# EAGLE design main_pcb_v2 (EAGLE 9.2.2)
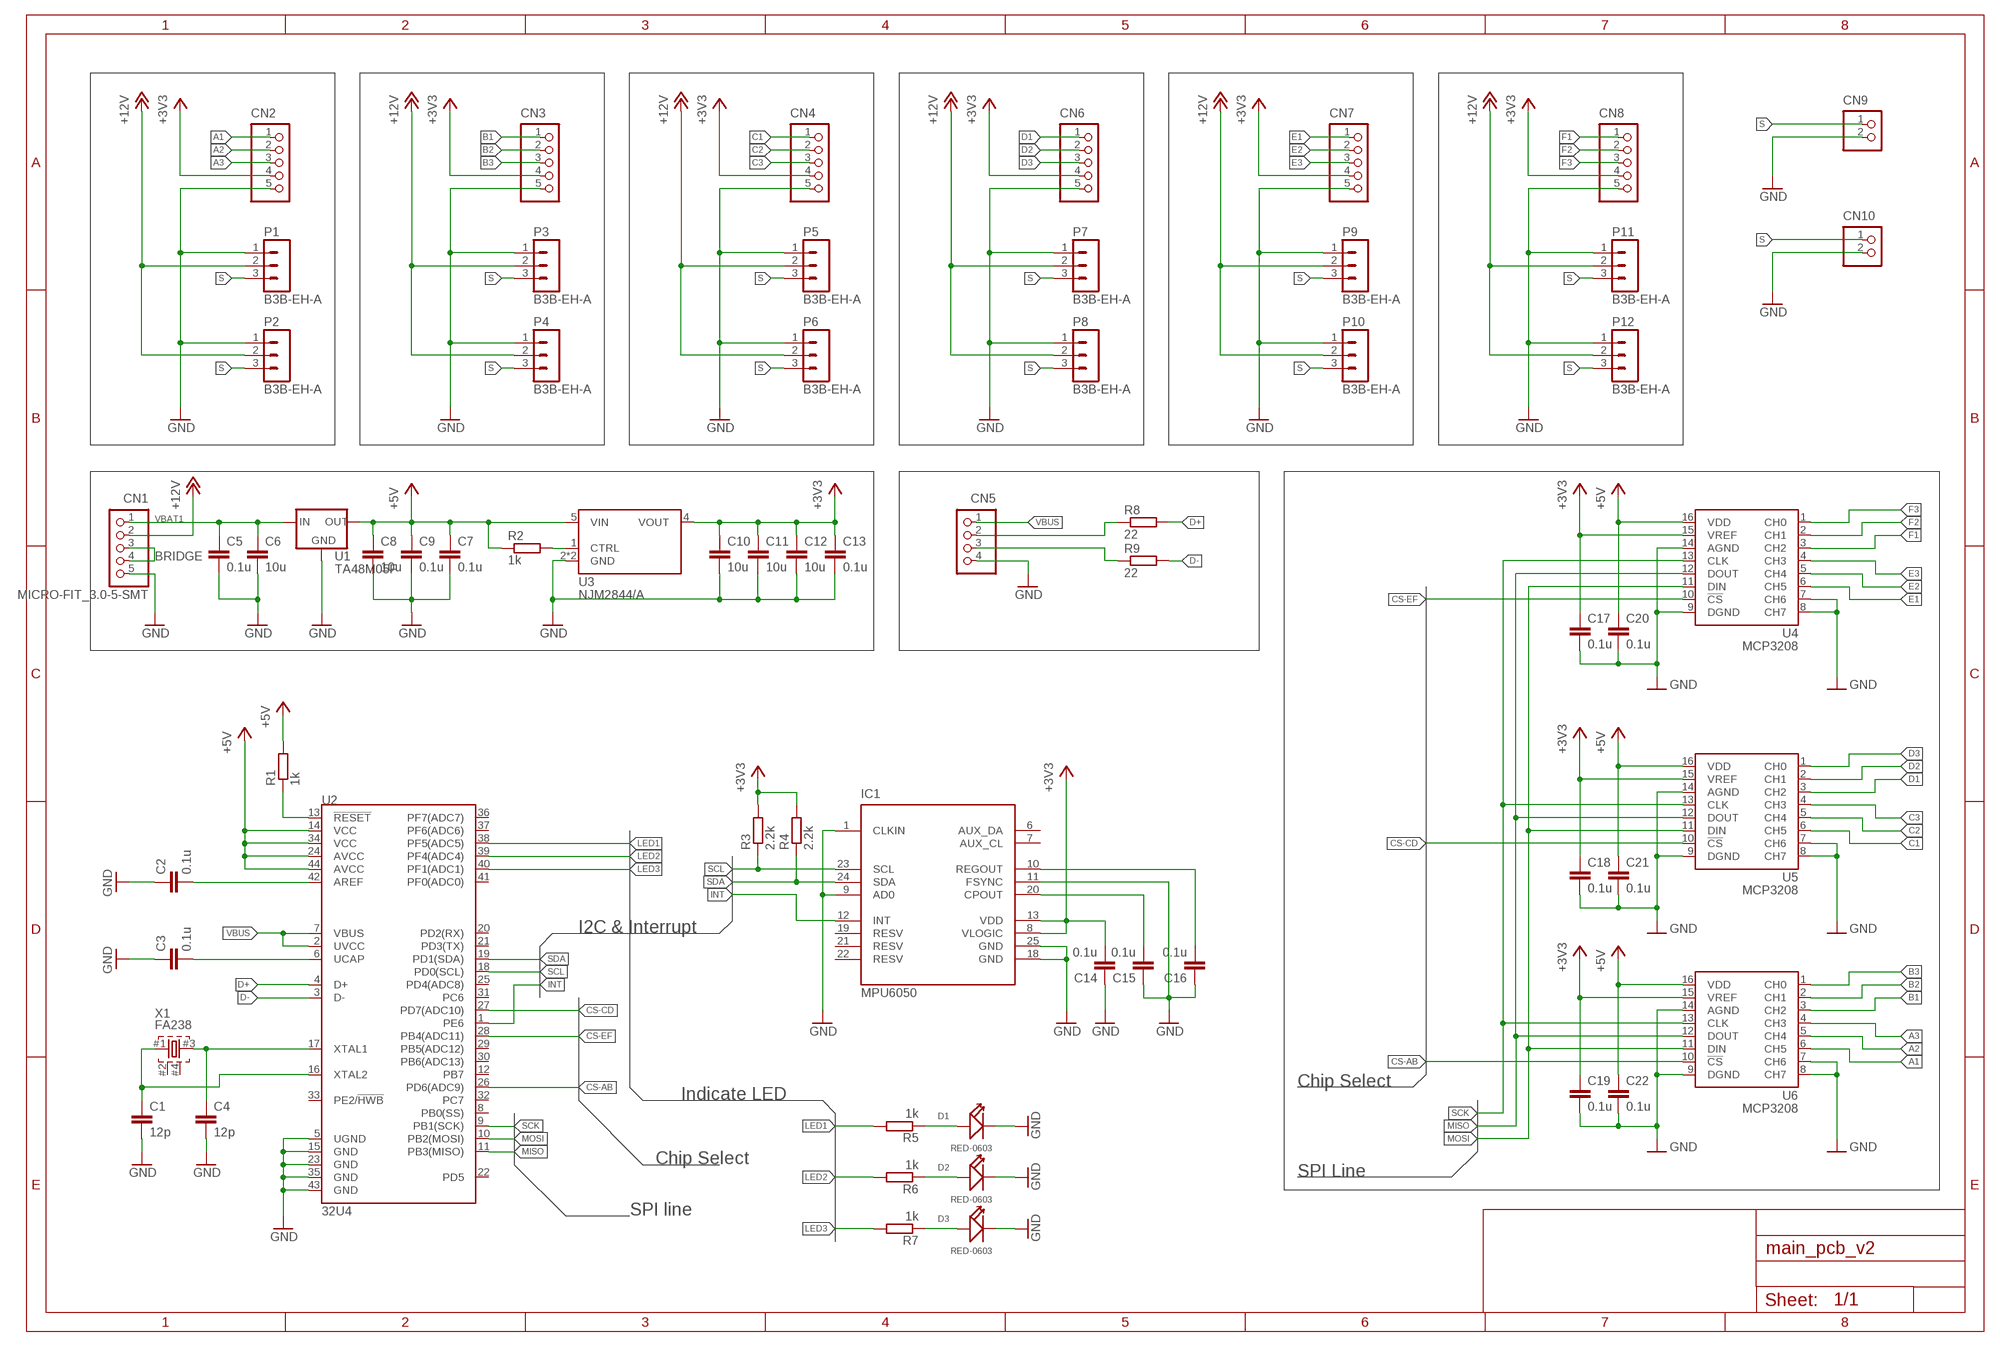
[diagram p0: schematic, sheet 1]

## Parts
C1  12p  C-EUC0603  [C0603]
C2  0.1u  C-EUC0603  [C0603]
C3  0.1u  C-EUC0603  [C0603]
C4  12p  C-EUC0603  [C0603]
C5  0.1u  C-EUC0603  [C0603]
C6  10u  C-EUC0805  [C0805]
C7  0.1u  C-EUC0603  [C0603]
C8  10u  C-EUC0805  [C0805]
C9  0.1u  C-EUC0603  [C0603]
C10  10u  C-EUC0805  [C0805]
C11  10u  C-EUC0805  [C0805]
C12  10u  C-EUC0805  [C0805]
C13  0.1u  C-EUC0603  [C0603]
C14  0.1u  C-EUC0603  [C0603]
C15  0.1u  C-EUC0603  [C0603]
C16  0.1u  C-EUC0603  [C0603]
C17  0.1u  C-EUC0603  [C0603]
C18  0.1u  C-EUC0603  [C0603]
C19  0.1u  C-EUC0603  [C0603]
C20  0.1u  C-EUC0603  [C0603]
C21  0.1u  C-EUC0603  [C0603]
C22  0.1u  C-EUC0603  [C0603]
CN1  MICRO-FIT_3.0-5-SMT  [MICRO-FIT_3.0-5_SMT]
CN2  B5B-PH-K-S  [B5B-PH-K-S]
CN3  B5B-PH-K-S  [B5B-PH-K-S]
CN4  B5B-PH-K-S  [B5B-PH-K-S]
CN5  S4B-PH-K-S  [S4B-PH-K-S]
CN6  B5B-PH-K-S  [B5B-PH-K-S]
CN7  B5B-PH-K-S  [B5B-PH-K-S]
CN8  B5B-PH-K-S  [B5B-PH-K-S]
CN9  B2B-PH-K-S  [B2B-PH-K-S]
CN10  B2B-PH-K-S  [B2B-PH-K-S]
D1  RED-0603  LED-SMD-RED-DIFFUSED(0603)  [LED-0603]
D2  RED-0603  LED-SMD-RED-DIFFUSED(0603)  [LED-0603]
D3  RED-0603  LED-SMD-RED-DIFFUSED(0603)  [LED-0603]
IC1  MPU6050  [QFN50P400X400X95-25T265X275N]
P1  B3B-EH-A  [B3B-EH-A]
P2  B3B-EH-A  [B3B-EH-A]
P3  B3B-EH-A  [B3B-EH-A]
P4  B3B-EH-A  [B3B-EH-A]
P5  B3B-EH-A  [B3B-EH-A]
P6  B3B-EH-A  [B3B-EH-A]
P7  B3B-EH-A  [B3B-EH-A]
P8  B3B-EH-A  [B3B-EH-A]
P9  B3B-EH-A  [B3B-EH-A]
P10  B3B-EH-A  [B3B-EH-A]
P11  B3B-EH-A  [B3B-EH-A]
P12  B3B-EH-A  [B3B-EH-A]
R1  1k  R-EU_R0603  [R0603]
R2  1k  R-EU_R0603  [R0603]
R3  2.2k  R-EU_R0603  [R0603]
R4  2.2k  R-EU_R0603  [R0603]
R5  1k  R-EU_R0603  [R0603]
R6  1k  R-EU_R0603  [R0603]
R7  1k  R-EU_R0603  [R0603]
R8  22  R-EU_R0603  [R0603]
R9  22  R-EU_R0603  [R0603]
U1  TA48M05F  [HSOP3-P-2.30A]
U2  32U4  ATMEGA32U4_NOARDTQFP-44  [TQFP44]
U3  NJM2844/A  [SOT-89-5]
U4  MCP3208  [SO16]
U5  MCP3208  [SO16]
U6  MCP3208  [SO16]
X1  FA238  [OSC-FA238]

## Nets
+3V3: C10.1 C11.1 C12.1 C13.1 C14.2 C17.1 C18.1 C19.1 CN2.4 CN3.4 CN4.4 CN6.4 CN7.4 CN8.4 IC1.8(VLOGIC) IC1.13(VDD) R3.2 R4.2 U3.4(VOUT) U4.15(VREF) U5.15(VREF) U6.15(VREF)
+5V: C7.1 C8.1 C9.1 C20.1 C21.1 C22.1 R1.2 R2.1 U1.2(OUT) U2.14(VCC) U2.24(AVCC) U2.34(VCC) U2.44(AVCC) U3.5(VIN) U4.16(VDD) U5.16(VDD) U6.16(VDD)
+12V: CN1.2 P1.2 P2.2 P3.2 P4.2 P5.2 P6.2 P7.2 P8.2 P9.2 P10.2 P11.2 P12.2
A1: CN2.1 U6.6(CH5)
A2: CN2.2 U6.5(CH4)
A3: CN2.3 U6.4(CH3)
B1: CN3.1 U6.3(CH2)
B2: CN3.2 U6.2(CH1)
B3: CN3.3 U6.1(CH0)
BRIDGE: CN1.3 CN1.4
C1: CN4.1 U5.6(CH5)
C2: CN4.2 U5.5(CH4)
C3: CN4.3 U5.4(CH3)
CS-AB: U2.26(PD6(ADC9)) U6.10(!CS)
CS-CD: U2.27(PD7(ADC10)) U5.10(!CS)
CS-EF: U2.28(PB4(ADC11)) U4.10(!CS)
D1: CN6.1 U5.3(CH2)
D2: CN6.2 U5.2(CH1)
D3: CN6.3 U5.1(CH0)
D+: R8.2 U2.4(D+)
D-: R9.2 U2.3(D-)
E1: CN7.1 U4.6(CH5)
E2: CN7.2 U4.5(CH4)
E3: CN7.3 U4.4(CH3)
F1: CN8.1 U4.3(CH2)
F2: CN8.2 U4.2(CH1)
F3: CN8.3 U4.1(CH0)
GND: C1.2 C2.1 C3.1 C4.2 C5.2 C6.2 C7.2 C8.2 C9.2 C10.2 C11.2 C12.2 C13.2 C14.1 C15.1 C16.1 C17.2 C18.2 C19.2 C20.2 C21.2 C22.2 CN1.5 CN2.5 CN3.5 CN4.5 CN5.4 CN6.5 CN7.5 CN8.5 CN9.2 CN10.2 D1.- D2.- D3.- IC1.1(CLKIN) IC1.9(AD0) IC1.11(FSYNC) IC1.18(GND) IC1.25(GND) P1.1 P2.1 P3.1 P4.1 P5.1 P6.1 P7.1 P8.1 P9.1 P10.1 P11.1 P12.1 U1.3(GND) U2.5(UGND) U2.15(GND) U2.23(GND) U2.35(GND) U2.43(GND) U3.2'(GND) U3.2(GND) U4.7(CH6) U4.8(CH7) U4.9(DGND) U4.14(AGND) U5.7(CH6) U5.8(CH7) U5.9(DGND) U5.14(AGND) U6.7(CH6) U6.8(CH7) U6.9(DGND) U6.14(AGND)
INT: IC1.12(INT) U2.1(PE6)
LED1: R5.2 U2.38(PF5(ADC5))
LED2: R6.2 U2.39(PF4(ADC4))
LED3: R7.2 U2.40(PF1(ADC1))
MISO: U2.11(PB3(MISO)) U4.12(DOUT) U5.12(DOUT) U6.12(DOUT)
MOSI: U2.10(PB2(MOSI)) U4.11(DIN) U5.11(DIN) U6.11(DIN)
N$5: CN5.2 R8.1
N$6: CN5.3 R9.1
N$7: R2.2 U3.1(CTRL)
N$9: C4.1 U2.17(XTAL1) X1.#3
N$10: C1.1 U2.16(XTAL2) X1.#1
N$11: C3.2 U2.6(UCAP)
N$12: R1.1 U2.13(!RESET)
N$13: C2.2 U2.42(AREF)
N$14: C16.2 IC1.10(REGOUT)
N$15: D3.+ R7.1
N$16: C15.2 IC1.20(CPOUT)
N$17: D2.+ R6.1
N$18: D1.+ R5.1
S: CN9.1 CN10.1 P1.3 P2.3 P3.3 P4.3 P5.3 P6.3 P7.3 P8.3 P9.3 P10.3 P11.3 P12.3
SCK: U2.9(PB1(SCK)) U4.13(CLK) U5.13(CLK) U6.13(CLK)
SCL: IC1.23(SCL) R3.1 U2.18(PD0(SCL))
SDA: IC1.24(SDA) R4.1 U2.19(PD1(SDA))
VBAT1: C5.1 C6.1 CN1.1 U1.1(IN)
VBUS: CN5.1 U2.2(UVCC) U2.7(VBUS)
Unconnected: IC1.2(NC) IC1.3(NC) IC1.4(NC) IC1.5(NC) IC1.6(AUX_DA) IC1.7(AUX_CL) IC1.14(NC) IC1.15(NC) IC1.16(NC) IC1.17(NC) IC1.19(RESV) IC1.21(RESV) IC1.22(RESV) U2.8(PB0(SS)) U2.12(PB7) U2.20(PD2(RX)) U2.21(PD3(TX)) U2.22(PD5) U2.25(PD4(ADC8)) U2.29(PB5(ADC12)) U2.30(PB6(ADC13)) U2.31(PC6) U2.32(PC7) U2.33(PE2/!HWB) U2.36(PF7(ADC7)) U2.37(PF6(ADC6)) U2.41(PF0(ADC0)) X1.#2 X1.#4

## Notes on the sheet
- I2C & Interrupt
- Chip Select
- Indicate LED
- Chip Select
- SPI Line
- SPI line

## Library data of the parts
C1-C22 = rcl:C-EU: CAPACITOR, European symbol; SPICEPREFIX: C
CN1 = yunit-tech_eagle_library:MICRO-FIT_3.0-5-SMT
CN2-CN4 CN6-CN8 = jst-ph:B5B-PH-*: Wire-to-Board 2.0mm pitch top mount connector Source: http://www.jst-mfg.com/product/pdf/jpn/PH.pdf http://www.jst-mfg.com/product/detail.php?series=199
CN5 = jst-ph:S4B-PH-*: Wire-to-Board 2.0mm pitch side mount connector Source: http://www.jst-mfg.com/product/pdf/jpn/PH.pdf http://www.jst-mfg.com/product/detail.php?series=199
CN9 CN10 = jst-ph:B2B-PH-*: Wire-to-Board 2.0mm pitch top mount connector Source: http://www.jst-mfg.com/product/pdf/jpn/PH.pdf http://www.jst-mfg.com/product/detail.php?series=199
D1-D3 = Seeed-LED:LED-SMD-RED-DIFFUSED(0603): 304090042; MPN: 19-217-R6C-AL1M2VY-3T
IC1 = invensense:MPU6050: The triple-axis MEMS gyroscope
P1-P12 = con-jst-eh:B3B-EH-A: HEADER
R1-R9 = rcl:R-EU_: RESISTOR, European symbol; SPICEPREFIX: R
U1 = yunit-tech_eagle_library:TA48M05F
U2 = yunit-tech_eagle_library:ATMEGA32U4_NOARD: Atmel MCU, 32KByte Atmel 44-pin 8-bit Microcontroller with 32KBytes of ISP Flash and USB Controller Datasheet <http://cdn.sparkfun.com/datasheets/Dev/Arduino/Boards/ATMega32U4.pdf> SparkFun Products LilyPad Arduino USB - ATmega32U4 Board <https://www.sparkfun.com/products/12049> (DEV-12049) Pro Micro - 5V/16MHz <https://www.sparkfun.com/products/12640> (DEV-12640) Pro Micro - 3.3V/8MHz <https://www.sparkfun.com/products/12587> (DEV-12587) Fio v3 - ATmega32U4 <https://www.sparkfun.com/products/11520> (DEV-11520) Qduino Mini <https://www.sparkfun.com/products/13614> (DEV-13614) Makey Makey - Standard Kit <https://www.sparkfun.com/products/11511> (WIG-11511) Makey Makey Deluxe Kit <https://www.sparkfun.com/products/11519> (WIG-11519); PROD_ID: IC-11161
U3 = yunit-tech_eagle_library:NJM2844/A
U4-U6 = yunit-tech_eagle_library:MCP3208
X1 = yunit-tech_eagle_library:FA238

## Board
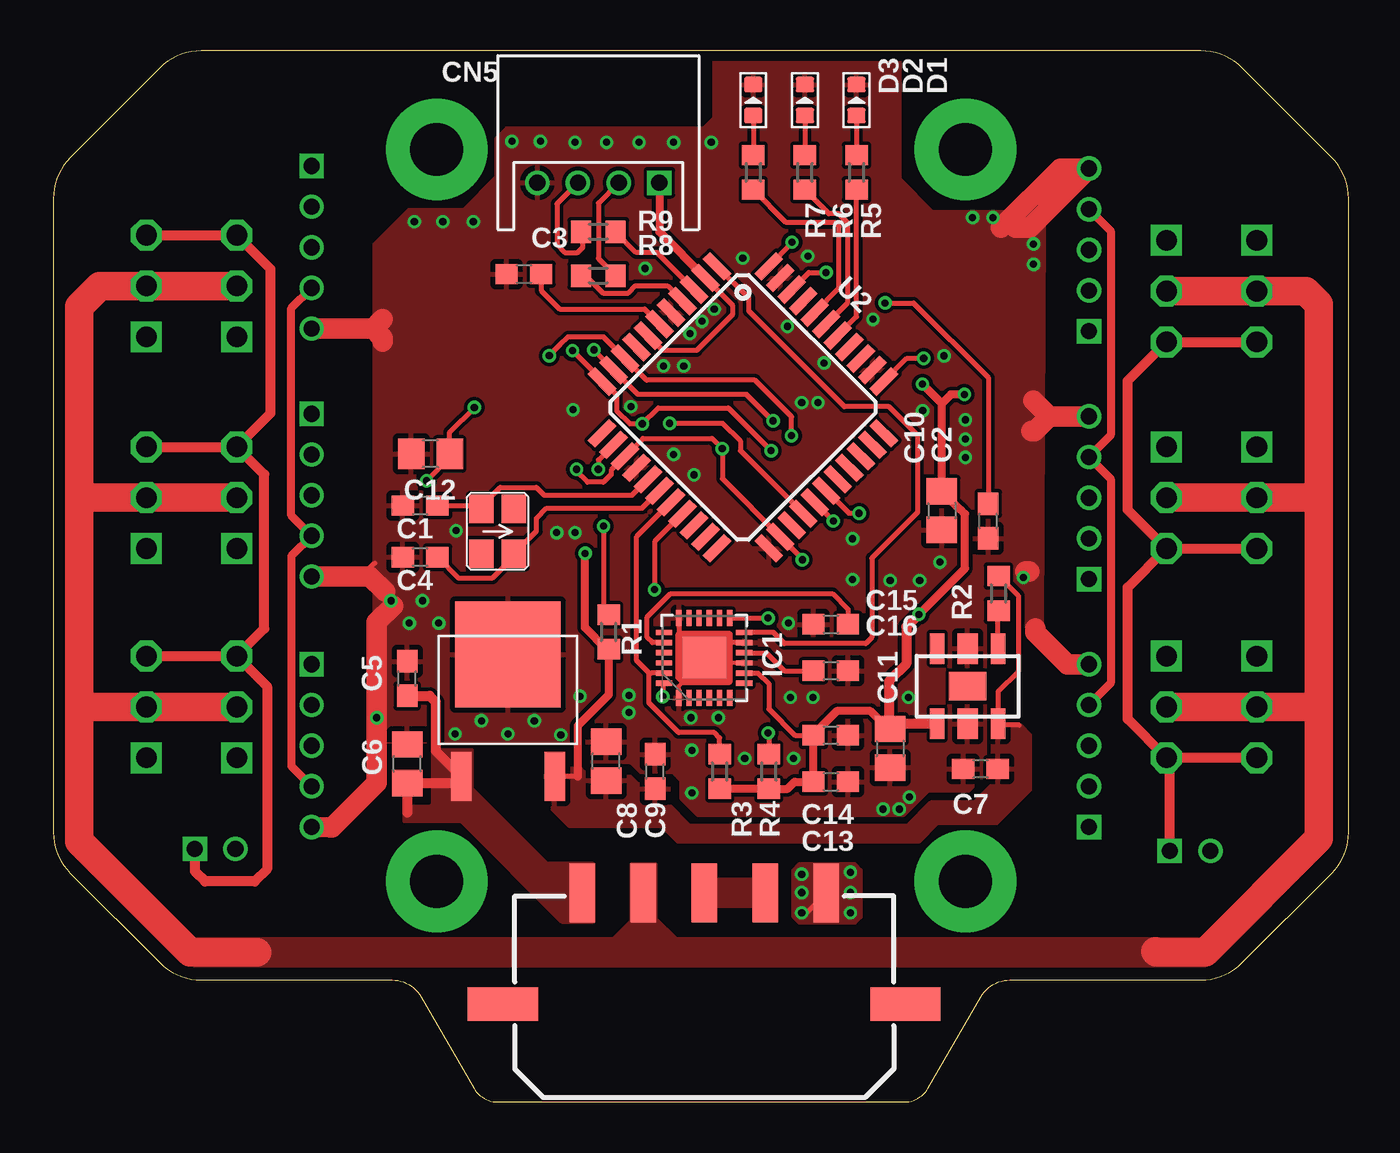
[diagram p1: board, top side]
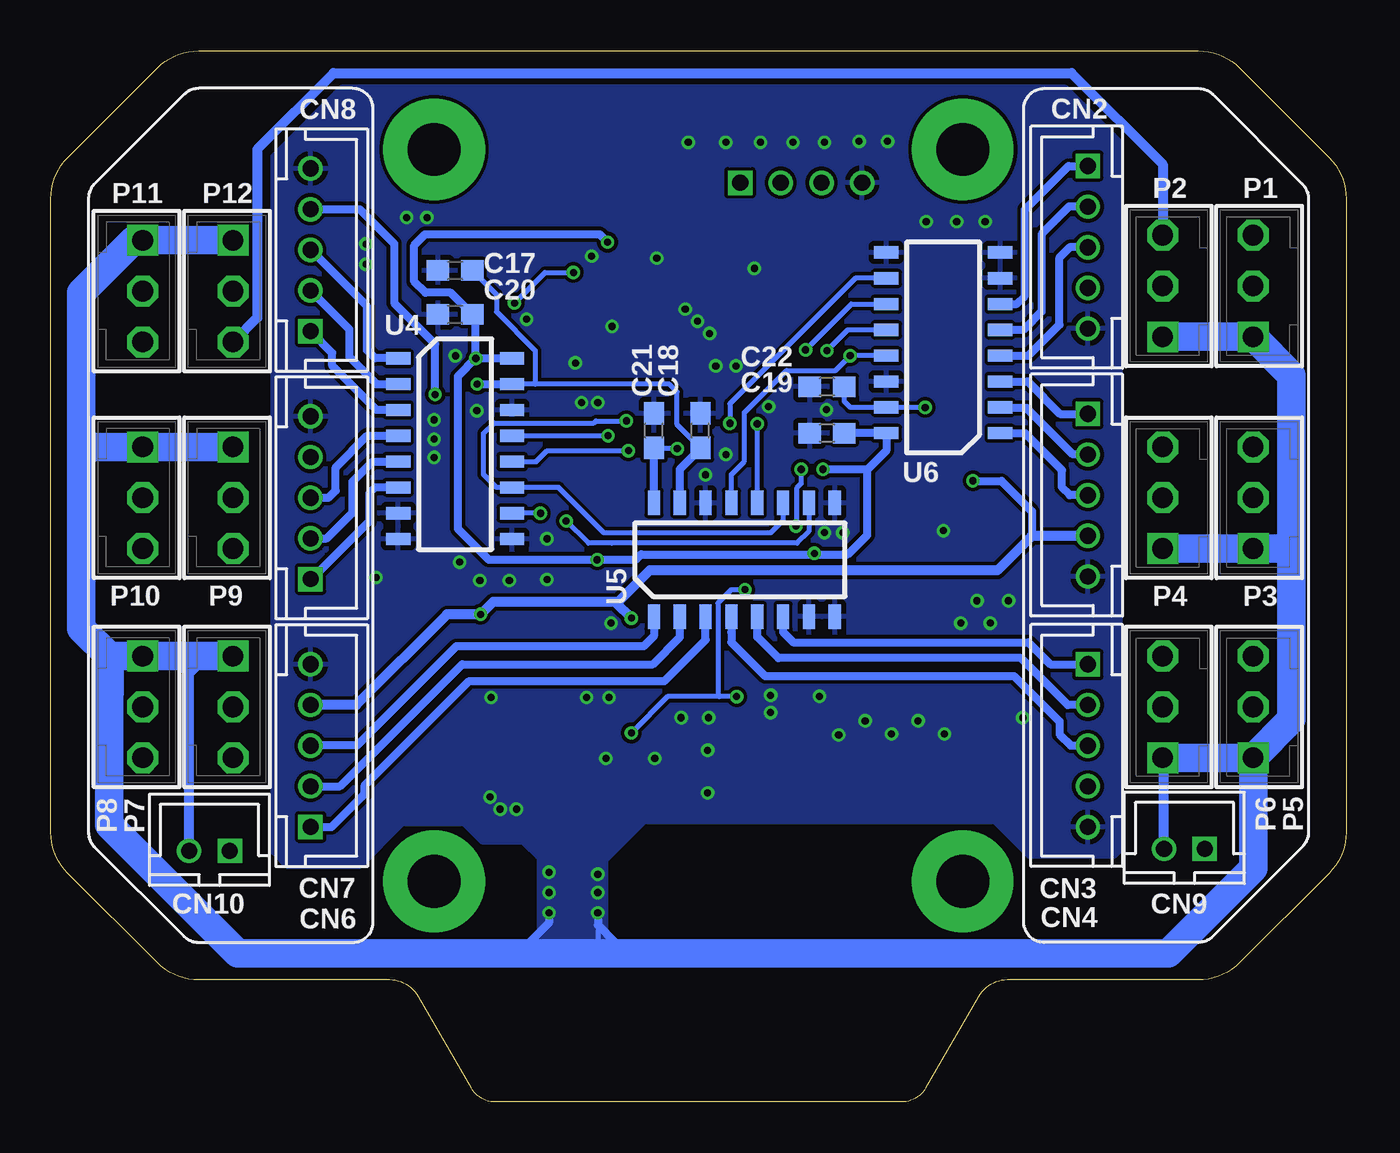
[diagram p2: board, bottom side, seen from below]

Size 63.7 x 51.7 mm. Coordinates in mm from the lower left corner, seen from the top.
Outline: 0.83,46.45 arc45 0,44.44 0,13.26 arc45 0.83,11.25 5.25,6.83 arc45 7.26,6 16.65,6 arc-60 18.08,5.17 20.68,0.68 arc60 21.85,0 41.85,0 arc60 43.02,0.68 45.62,5.17 arc-60 47.05,6 56.44,6 arc45 58.45,6.83 62.87,11.25 arc45 63.7,13.26 63.7,44.44 arc45 62.87,46.45 58.45,50.87 arc45 56.44,51.7 7.26,51.7 arc45 5.25,50.87 0.83,46.45
Copper layers (1*16): Top 0.035mm / dielectric 1.6mm / Bottom 0.035mm
Design rules "Elecrow_2-layer_PCB_eagle_rule": minimum track width 6mil, minimum drill 12mil, track to track 7mil, track to pad 7mil, pad to pad 7mil, via to via 8mil, smd to smd 0mil, copper to edge 20mil, drill to drill 10mil, minimum pad ring 6mil, minimum via ring 6mil, stop-mask expansion 0mil, vias tented up to drill 100mil, thermal gap 10mil

### Footprints (pad centres in the part's own frame; a part is rotated, then mirrored left to right if it is on the bottom)
C0603 = smd 1.1 x 1: 1 -0.85,0; 2 0.85,0
C0805 = smd 1.3 x 1.5: 1 -0.95,0; 2 0.95,0
MICRO-FIT_3.0-5_SMT = smd 1.25 x 2.9: 1 6,-5.45; 2 3,-5.45; 3 0,-5.45; 4 -3,-5.45; 5 -6,-5.45 | smd 3.45 x 1.65: PAD1 -9.9,0; PAD2 9.9,0
B5B-PH-K-S = drill 0.8 square: 1 -4,0 | drill 0.8: 2 -2,0; 3 0,0; 4 2,0; 5 4,0
S4B-PH-K-S = drill 0.8 square: 1 3,0 | drill 0.8: 2 1,0; 3 -1,0; 4 -3,0
B2B-PH-K-S = drill 0.8 square: 1 -1,0 | drill 0.8: 2 1,0
LED-0603 = smd 0.762 x 0.889: + -0.762,0; - 0.762,0
QFN50P400X400X95-25T265X275N = smd 0.26 x 0.79: 1 -1.25,-1.97; 2 -0.75,-1.97; 3 -0.25,-1.97; 4 0.25,-1.97; 5 0.75,-1.97; 6 1.25,-1.97; 13 1.25,1.97; 14 0.75,1.97; 15 0.25,1.97; 16 -0.25,1.97; 17 -0.75,1.97; 18 -1.25,1.97 | smd 0.79 x 0.26: 7 1.97,-1.25; 8 1.97,-0.75; 9 1.97,-0.25; 10 1.97,0.25; 11 1.97,0.75; 12 1.97,1.25; 19 -1.97,1.25; 20 -1.97,0.75; 21 -1.97,0.25; 22 -1.97,-0.25; 23 -1.97,-0.75; 24 -1.97,-1.25 | smd 2.15 x 2.05: 25 0,0
B3B-EH-A = drill 1.016 square: 1 -2.5,0 | drill 1.016 octagon: 2 0,0; 3 2.5,0
R0603 = smd 1 x 1.1: 1 -0.85,0; 2 0.85,0
HSOP3-P-2.30A = smd 1 x 2.4: 1 -2.3,-3.8; 2 2.3,-3.8 | smd 5.2 x 5.2: 3 0,2.2
TQFP44 = smd 1.5 x 0.5: 1 -5.8,4; 2 -5.8,3.2; 3 -5.8,2.4; 4 -5.8,1.6; 5 -5.8,0.8; 6 -5.8,0; 7 -5.8,-0.8; 8 -5.8,-1.6; 9 -5.8,-2.4; 10 -5.8,-3.2; 11 -5.8,-4; 23 5.8,-4; 24 5.8,-3.2; 25 5.8,-2.4; 26 5.8,-1.6; 27 5.8,-0.8; 28 5.8,0; 29 5.8,0.8; 30 5.8,1.6; 31 5.8,2.4; 32 5.8,3.2; 33 5.8,4 | smd 0.5 x 1.5: 12 -4,-5.8; 13 -3.2,-5.8; 14 -2.4,-5.8; 15 -1.6,-5.8; 16 -0.8,-5.8; 17 0,-5.8; 18 0.8,-5.8; 19 1.6,-5.8; 20 2.4,-5.8; 21 3.2,-5.8; 22 4,-5.8; 34 4,5.8; 35 3.2,5.8; 36 2.4,5.8; 37 1.6,5.8; 38 0.8,5.8; 39 0,5.8; 40 -0.8,5.8; 41 -1.6,5.8; 42 -2.4,5.8; 43 -3.2,5.8; 44 -4,5.8
SOT-89-5 = smd 0.7 x 1.5: 1 -1.5,-1.85; 3 1.5,-1.85; 4 1.5,1.85; 5 -1.5,1.85 | smd 1 x 1.5: 2 0,-1.85; 2' 0,1.85 | smd 1.829 x 1.397: PAD 0,0
SO16 = smd 0.6 x 1.2: 1 -4.445,-2.8; 2 -3.175,-2.8; 3 -1.905,-2.8; 4 -0.635,-2.8; 5 0.635,-2.8; 6 1.905,-2.8; 7 3.175,-2.8; 8 4.445,-2.8; 9 4.445,2.8; 10 3.175,2.8; 11 1.905,2.8; 12 0.635,2.8; 13 -0.635,2.8; 14 -1.905,2.8; 15 -3.175,2.8; 16 -4.445,2.8
OSC-FA238 = smd 1.4 x 1.2: #1 -1.1,-0.8; #2 1.1,-0.8; #3 1.1,0.8; #4 -1.1,0.8

### Placement (x,y rotation side)
C1  18.03,29.34 180 top
C2  45.97,28.57 90 top
C3  23.13,40.72 0 top
C4  18.03,26.8 180 top
C5  17.4,20.83 90 top
C6  17.4,16.64 90 top
C7  45.59,16.38 180 top
C8  27.18,16.76 90 top
C9  29.59,16.26 90 top
C10  43.69,29.08 270 top
C11  41.15,17.4 270 top
C12  18.54,31.88 180 top
C13  38.23,15.75 0 top
C14  38.23,18.03 180 top
C15  38.23,23.5 0 top
C16  38.23,21.21 180 top
C17  43.81,40.89 180 bottom
C18  31.75,33.02 90 bottom
C19  25.53,35.18 180 bottom
C20  43.81,38.73 180 bottom
C21  34.04,33.02 90 bottom
C22  25.53,32.89 180 bottom
CN1  32,4.83 180 top
CN2  12.7,42.04 270 bottom
CN3  12.7,29.84 270 bottom
CN4  12.7,17.53 270 bottom
CN5  26.8,45.21 0 top
CN6  50.93,17.53 90 bottom
CN7  50.93,29.72 90 bottom
CN8  50.93,41.91 90 bottom
CN9  7.95,12.45 180 bottom
CN10  55.9,12.35 180 bottom
D1  39.5,49.28 90 top
D2  36.96,49.28 90 top
D3  34.42,49.28 90 top
IC1  32,21.84 0 top
P1  4.57,40.13 90 bottom
P2  9.02,40.13 90 bottom
P3  4.57,29.72 90 bottom
P4  9.02,29.72 90 bottom
P5  4.57,19.43 90 bottom
P6  9.02,19.43 90 bottom
P7  54.74,19.43 270 bottom
P8  59.18,19.43 270 bottom
P9  54.74,29.72 270 bottom
P10  59.18,29.72 270 bottom
P11  59.18,39.88 270 bottom
P12  54.74,39.88 270 bottom
R1  27.3,23.11 270 top
R2  46.48,25.02 270 top
R3  32.77,16.26 270 top
R4  35.18,16.26 270 top
R5  39.5,45.72 270 top
R6  36.96,45.72 270 top
R7  34.42,45.72 270 top
R8  26.8,40.64 180 top
R9  26.8,42.8 0 top
U1  22.35,19.81 0 top
U2  33.91,34.16 315 top
U3  44.96,20.45 180 top
U4  43.81,32.13 270 bottom
U5  29.59,26.67 0 bottom
U6  19.81,37.34 90 bottom
X1  21.84,28.07 270 top

### Tracks (layer width: path | path; a pad name or v marks a point on that pad's centre or on a via)
+3V3  (via drill 0.35)
  Top 0.25: 37.38,18.07 C14.2 36.47,18.03 35.18,19.33 35.18,20.57 34.66,21.09 IC1.8 | 41.4,18.6 C11.1 | C12.1 19.49,32.95 v20.7,34.16 | IC1.13 35.14,23.81 v35.15,23.8 | v18.35,30.55 19.49,31.69
  Top 0.4: C14.2 C13.1 36.45,15.75 36.11,15.41 R4.2 R3.2 | C11.1 41.05,18.35 | 41.05,18.35 40.17,19.23 38.53,19.23 37.38,18.07 | CN4.4 11.7,16.53 11.7,26.84 CN3.4 11.7,28.84 11.7,39.04 CN2.4 | CN8.4 52,42.84 52,32.79 CN7.4 52,30.64 52,20.6 CN6.4 | 43.69,34.35 v42.74,35.31 | 43.69,34.35 C10.1 44.56,29.16 44.59,29.16 44.83,28.92 44.83,26.25 v42.57,23.98 | v44.8,34.8 44.13,34.8 43.69,34.35 | 19.49,31.69 C12.1 | 41.1,18.4 41.05,18.35
  Top 0.5: U3.4 41.4,18.6 | v42.57,23.98 41.95,23.37 41.95,21.55 41.1,20.7 41.1,18.4
  Bottom 0.25: 40.64,35.31 U4.15 39.88,35.31 | C17.1 41.78,39.71 41.78,38.86 39.88,36.96 39.88,35.31 | v20.7,34.16 U6.15 24.38,34.16 24.68,34.46 C19.1 | C18.1 32.89,33.31 32.89,34.92 33.27,35.31 39.88,35.31
  Bottom 0.4: U5.15 32.77,31.13 31.75,32.14 C18.1 | v42.74,35.31 U4.15 | CN8.4 48.51,43.91 46.81,42.21 46.81,39.29 44.8,37.29 v44.8,34.8 | v18.35,30.55 16.95,30.55 15.45,29.05 15.45,27.85 15.46,27.84
  Bottom 0.5: v35.15,23.8 35.88,24.52 | 35.88,24.52 35.95,24.6 41.95,24.6 v42.57,23.98 44.22,23.98 48.67,19.53 CN6.4 | 35.88,24.52 34.25,26.15 17.15,26.15 15.46,27.84 CN3.4
+5V  (via drill 0.35)
  Top 0.25: 25.78,16 24.66,16 U1.2 | R2.1 47.45,24.9 47.45,21.16 46.46,20.17 U3.5 46.51,18.54 47.5,18.54 | U2.34 41.98,36.58 v42.8,36.58 | U2.44 36.32,42.23 v36.32,42.29 | v25.73,31.11 25.68,31.07 26.26,30.48 27.05,30.48 27.43,30.85 27.43,31.07 U2.14 28.99,32.64 32.38,32.64 v32.89,32.13 32.89,30.65 U2.24 36.83,26.72
  Top 0.4: 36.83,26.72 v36.83,26.67 | 25.78,16 25.78,18.5 27.3,20.03 R1.2 27.2,22.26 26.14,23.33 26.14,26.97 v26.15,26.98
  Bottom 0.25: v32.89,32.13 34.04,32.13 | C22.1 24.66,32.88
  Bottom 0.4: U5.16 34.04,32.13 C21.1 | U4.16 42.67,36.58 42.8,36.45 v42.8,36.58 | v42.8,36.58 42.8,38.57 C20.1 44.03,39.8 45.27,39.8 45.83,40.36 45.83,42.14 45.3,42.67 36.7,42.67 v36.32,42.29 | v42.8,36.58 43.69,35.69 43.69,28.19 42.16,26.67 v36.83,26.67 34.93,26.67 34.67,26.93 26.2,26.93 v26.15,26.98 26.1,26.93 24.5,26.93 23.55,27.89 23.55,31.1 | C22.1 U6.16 22.61,32.04 23.55,31.1 | 23.55,31.1 25.71,31.1 v25.73,31.11
  pour Top: 24.26,16.38 25.91,16.38 26.16,16.13 28.19,16.13 28.7,15.62 30.23,15.62 30.23,14.61 31.24,13.59 42.04,13.59 43.18,14.73 45.34,14.73 46.23,15.62 46.23,18.54 47.5,18.54 48.01,18.03 48.01,15.37 46.35,13.72 43.43,13.72 42.55,12.83 30.73,12.83 29.97,13.59 25.4,13.59 24.26,14.73
+12V
  Top 1.4: 1.27,19.3 1.27,12.83 1.27,12.82 6.73,7.37 10.02,7.37 | 1.27,19.3 1.27,29.72 | 1.27,29.72 1.27,39.12 2.29,40.13 P1.2 P2.2 | P4.2 P3.2 1.27,29.72 | P6.2 P5.2 1.4,19.43 1.27,19.3 | 62.23,19.3 62.23,12.95 56.64,7.37 54.23,7.37 54.2,7.4 | 62.23,19.3 62.23,29.72 | 62.23,29.72 62.23,39.24 61.59,39.88 P11.2 P12.2 | P9.2 P10.2 62.23,29.72 | P7.2 P8.2 62.1,19.43 62.23,19.3
  pour Top (no thermals): 28.45,11.68 29.59,11.68 29.59,9.02 30.61,8 56.65,8 56.65,6.73 6.93,6.73 6.93,8 27.56,8 28.45,8.89
A1
  Bottom 0.4: U6.6 16.2,39.24 15.8,39.64 15.8,43.89 13.65,46.04 CN2.1
A2
  Bottom 0.4: CN2.2 13.62,44.04 14.97,42.68 14.97,38.87 15.88,37.97 U6.5
A3
  Bottom 0.4: CN2.3 13.59,42.04 14.1,41.53 14.1,38.23 15.62,36.7 U6.4
B1
  Bottom 0.4: U6.3 15.65,35.43 14.06,33.84 CN3.1
B2
  Bottom 0.4: CN3.2 13.43,31.84 15.72,34.13 16.98,34.13 U6.2
B3
  Bottom 0.4: U6.1 15.79,32.89 13.97,31.07 13.97,30.23 13.59,29.84 CN3.3
BRIDGE
  pour Top (no thermals): 31.5,10.92 35.43,10.92 35.43,9.65 31.5,9.65
C1
  Bottom 0.4: U5.6 27.69,23.11 27.18,22.61 15.62,22.61 14.54,21.53 CN4.1
C2
  Bottom 0.4: CN4.2 13.68,19.53 15.99,21.83 27.92,21.83 28.96,22.86 U5.5
C3
  Bottom 0.4: U5.4 30.23,23.1 30.23,22.61 28.57,20.95 16.33,20.95 14.1,18.72 14.1,18.08 13.54,17.53 CN4.3
CS-AB  (via drill 0.35)
  Top 0.25: U2.26 33.78,32.03 33.78,32.51 32.91,33.38 v30.3,33.38
  Bottom 0.25: U6.10 24.13,40.51 30.3,34.34 v30.3,33.38
CS-CD  (via drill 0.35)
  Top 0.25: v38.35,28.57 37.45,29.48 U2.27
  Bottom 0.25: U5.10 26.42,28.07 27,27.49 36.1,27.49 37.27,27.49 v38.35,28.57
CS-EF  (via drill 0.35)
  Top 0.25: U2.28 39.12,28.96 v39.62,28.96
  Bottom 0.25: v39.62,28.96 U4.10
D1
  Bottom 0.4: CN6.1 49.89,13.53 48.26,15.16 48.26,15.57 43.13,20.7 33.53,20.7 31.5,22.73 U5.3
D2
  Bottom 0.4: CN6.2 49.47,15.53 43.47,21.53 34.09,21.53 32.77,22.86 U5.2
D3
  Bottom 0.4: U5.1 34.04,22.91 34.54,22.41 43.76,22.41 48.64,17.53 CN6.3
D+
  Top 0.25: U2.4 30.2,40.14 28.62,40.14 28.27,39.79 27.02,39.79 26.17,40.64 R8.2
D-
  Top 0.25: U2.3 29.68,41.78 28.66,41.78 R9.2
E1
  Bottom 0.4: U4.6 47.75,30.23 48.04,29.94 48.04,28.55 50.87,25.72 CN7.1
E2
  Bottom 0.4: CN7.2 50.13,27.72 48.87,28.98 48.87,30.51 47.88,31.5 U4.5
E3
  Bottom 0.4: CN7.3 50.04,29.72 49.69,30.06 49.69,31.21 48.13,32.77 U4.4
F1
  Bottom 0.4: U4.3 47.68,34.04 49.86,36.21 49.86,36.84 CN8.1
F2
  Bottom 0.4: CN8.2 49.03,38.01 49.03,36.66 47.68,35.31 U4.2
F3
  Bottom 0.4: U4.1 47.75,36.58 48.15,36.98 48.15,39.13 CN8.3
GND  (via drill 0.35)
  Top 0.2: IC1.9 32.25,21.59 IC1.25 32,21.7 30.75,20.45 IC1.1
  Top 0.25: 14.8,25.84 15.14,25.84 15.8,26.5 | CN1.5 37.03,9.3 v36.8,9.3 | IC1.11 32.75,22.59 32.1,21.95 | 32.1,21.95 IC1.25 | IC1.18 30.75,23 31.8,21.95 32.1,21.95
  Top 1: CN4.5 13.6,13.5 13.7,13.5 15.9,15.7 15.9,23.6 16.7,24.4 | CN3.5 14.8,25.84 15.55,25.84 16.3,25.1 | CN2.5 15.74,38.04 | 15.74,38.04 16.2,38.5 | 15.74,38.04 16.2,37.57 16.2,37.4 | 47.3,43 48.02,43 CN8.5 49.51,45.91 46.6,43 | CN7.5 48.98,33.72 | 48.98,33.72 48.2,34.5 | 48.98,33.72 48.26,33 48.1,33 | 48,26.1 47.8,26.1 | CN6.5 49.87,21.53 48.3,23.1 48.3,23.3
  Bottom 0.25: v36.8,9.3 36.8,7.9 36.2,7.3
  Bottom 0.4: v36.8,9.3 36.8,8.7 36,7.9 | v39.2,9.3 39.2,8.8 40.2,7.8
  Bottom 0.5: CN10.2 56.9,21.08 | 56.9,21.08 56.05,21.93 | 56.9,21.08 57.55,21.73 57.55,21.93 | 7.5,16.83 7.5,16.93 | CN9.2 8.95,16.86 P6.1
  Bottom 1: 9.09,37.7 P2.1 | 50.95,21.5 CN6.5 | 54.7,42.41 P12.1
  Bottom 1.4: P2.1 P1.1 2.7,35.76 2.7,27.1 | P6.1 7.5,16.93 P5.1 | P4.1 P3.1 2.82,27.22 2.7,27.1 | P12.1 P11.1 59.62,42.38 62.2,39.8 62.2,32.1 | 62.2,32.1 62.2,23.3 60.8,21.9 | P7.1 56.05,21.93 57.55,21.93 P8.1 60.77,21.93 60.8,21.9 | P9.1 P10.1 62.08,32.22 62.2,32.1 | 60.8,21.9 60.8,20.13 60.82,20.11 60.82,13.62 54.5,7.3 36.2,7.3 8.75,7.3 4.57,11.48 P5.1 | P5.1 2.7,18.8 2.7,27.1
  other vias: 36.8,11.2 36.8,10.3 39.2,11.3 39.2,10.3 28.4,34.2 31.3,37.8 32.5,39 31.9,38.4 36.25,19.9 37.35,19.9 42.05,19.9 20.65,43.3 34,16.9 36.4,16.9 28.3,19.15 28.3,20 36.15,23.55 32.35,47.2 30,36.2 37.1,41.6 25.55,34.05 15.9,18.9 25.65,28 18.95,23.55 39.3,27.7 25.9,19.95 19.8,28.1 43.8,36.7 40.3,38.5 44.85,32.6 44.85,33.55 41.6,14.4 42.1,15 40.8,14.4 31.4,15.2 31.4,17.3 17.75,43.3 22.55,47.25 27.2,47.2 19.15,43.3 23.95,47.25 25.65,47.2 29.1,41 28.8,47.2 30.5,47.2 33.9,41.5 43.6,26.55 47.7,25.8 48.2,42.2 48.2,41.2 46.2,43.5 45.2,43.5 31.35,18.9 32.7,18.9 31.5,30.85 30.5,31.85 37.9,36.35 36.1,38.15 36.8,34.4 37.6,34.4 39.3,25.7 24.75,28 31,36.2 42.75,34 44.85,31.7 17.5,23.55 18.15,24.65 16.6,24.65 19.75,18.1 21.05,18.75 22.35,18.1 23.65,18.75 24.95,18.05 42.6,25.65 41.15,25.65
  pour Top: 32.5,51.3 41.6,51.3 41.6,45.4 43.2,43.8 48.2,43.8 48.7,43.3 48.61,23.4 45.8,23.4 45.8,16.1 45,15.3 43,15.3 41.8,14.1 31.7,14.1 30.9,14.9 30.9,15.8 30.5,16.2 28.9,16.2 28.4,16.7 26.5,16.7 25.5,17.7 15.8,17.7 15.8,42.2 17.5,43.9 20.2,43.9 21.8,45.5 21.8,47.4 22.3,47.9 32,47.9 32.5,48.4
  pour Top (no thermals): 38,11.7 39.4,11.7 39.7,11.4 39.7,9.1 39.4,8.8 36.7,8.8 36.4,9.1 36.4,11.4 36.7,11.7
  pour Bottom: 39.7,12 39.7,6.8 36.4,6.8 36.4,11.9 34.5,13.8 17.3,13.8 15.6,12.1 11.4,12.1 11.1,12.4 11.1,47.2 13.8,49.9 49.4,49.9 52.8,46.5 52.8,12.3 52.1,11.6 48.5,11.6 46.4,13.7 43.4,13.7 42.5,12.8 40.5,12.8
INT
  Top 0.25: U2.1 34.2,39.53 34.2,38.9 38.9,34.2 41.1,34.2 42.5,32.8 42.5,29 40.25,26.75 40.25,22.85 39.95,22.55 35.95,22.55 35.4,23.1 IC1.12
LED1
  Top 0.25: U2.38 39.5,38.62 R5.2
LED2
  Top 0.25: U2.39 39.07,39.32 39.07,43.23 38.61,43.69 38.14,43.69 R6.2
LED3
  Top 0.25: U2.40 38.64,40.03 38.64,43.05 38.43,43.26 36.03,43.26 R7.2
MISO  (via drill 0.35)
  Top 0.25: v25.53,36.96 26.98,35.51 U2.11 | U2.11 27.05,35.44 27.7,34.79 27.7,34 28.34,33.35 v28.96,33.35 29.74,34.14 33.19,34.14 v35.3,32.03 | U2.11 26.98,35.4
  Bottom 0.25: U6.12 24.51,37.97 v25.53,36.96 | U5.12 v28.96,33.35 | U4.12 39.83,31.5 39.3,32.03 v35.3,32.03
MOSI  (via drill 0.35)
  Top 0.25: v26.58,36.99 26.58,36.97 U2.10 28.74,34.8 34.09,34.8 v35.4,33.5
  Bottom 0.25: v26.58,36.99 24.33,39.24 U6.11 | v35.4,33.5 36.9,33.5 36.99,33.4 41.91,33.4 42.42,32.89 42.42,30.86 41.78,30.23 U4.11 38.73,30.23 36.49,27.99 28.3,27.99 27.69,28.6 U5.11
N$1  (via drill 2.6 pad 5)
  other vias: 18.85,10.85
N$2  (via drill 2.6 pad 5)
  other vias: 44.85,10.85
N$3  (via drill 2.6 pad 5)
  other vias: 44.85,46.85
N$4  (via drill 2.6 pad 5)
  other vias: 18.85,46.85
N$5
  Top 0.25: CN5.2 26.8,44.21 26.8,41.49 R8.1
N$6
  Top 0.25: CN5.3 24.77,44.18 24.77,42.16 25.15,41.78 25.78,41.78 26.04,42.04 26.04,42.71 R9.1
N$7
  Top 0.25: U3.1 46.46,24.14 R2.2
N$9
  Top 0.25: C4.1 19.9,25.78 21.59,25.78 22.64,26.84 X1.#3 23.75,28.07 23.75,28.7 24.26,29.21 28.96,29.21 U2.17
N$10
  Top 0.25: C1.1 20.87,29.34 X1.#1 21.04,29.3 21.97,30.23 23.75,30.23 24.13,29.84 28.46,29.84 U2.16
N$11
  Top 0.25: C3.2 23.98,39.92 24.9,39 29.07,39 U2.6
N$12  (via drill 0.35)
  Top 0.25: U2.13 26.8,31.58 v26.8,31.11 | v27.05,28.32 27.05,24.22 R1.1
  Bottom 0.25: v26.8,31.11 26.8,30.42 27.02,30.2 27.02,28.35 v27.05,28.32
N$13  (via drill 0.35)
  Top 0.25: U2.42 37.15,40.8 v38,40.8 | v40.9,39.3 42.3,39.3 45.97,35.63 C2.2
  Bottom 0.25: v40.9,39.3 39.4,40.8 v38,40.8
N$14
  Top 0.25: IC1.10 35.06,22.09 35.94,21.21 C16.2
N$15
  Top 0.25: D3.+ R7.1
N$16
  Top 0.25: IC1.20 29.46,22.59 29.2,22.85 29.2,23.85 30.35,25 38.3,25 39.08,24.22 C15.2
N$17
  Top 0.25: D2.+ R6.1
N$18
  Top 0.25: D1.+ R5.1
S
  Top 0.5: P3.3 P4.3 | P1.3 P2.3 10.67,40.98 10.67,33.87 P4.3 | P5.3 P6.3 | P6.3 10.37,23.28 10.37,30.87 P4.3 | P8.3 P7.3 | P7.3 52.83,18.84 52.83,25.31 P9.3 | P9.3 P10.3 | P9.3 52.83,29.12 52.83,35.47 P12.3 P11.3 | P6.3 10.5,20.45 10.5,11.45 9.9,10.85 7.45,10.85 6.95,11.35 CN9.1 | CN10.1 54.9,16.77 P7.3
  Bottom 0.5: P12.3 53.55,38.57 53.55,46.85 49.8,50.6 13.5,50.6 9.02,46.12 P2.3
SCK  (via drill 0.35)
  Top 0.25: v24.38,36.7 24.9,37.22 25.3,37.62 27.05,37.62 U2.9 29.18,35.5 34.5,35.5 36.3,33.7 v36.3,32.77
  Bottom 0.25: U6.13 v24.38,36.7 25.11,35.98 27.52,35.98 29.59,33.92 29.59,31.5 30.23,30.86 U5.13 | 41.15,32.77 U4.13 v36.3,32.77 | 30.23,29.34 U5.13 | U5.13 30.23,29.08
SCL
  Top 0.25: R3.1 32.77,17.91 32.51,18.16 30.75,18.16 29.29,19.63 29.29,21.1 | U2.18 28.68,27.8 28.68,21.7 29.29,21.1 | 29.29,21.1 29.34,21.05 29.38,21.09 IC1.23
SDA  (via drill 0.35)
  Top 0.25: IC1.24 29.98,20.54 29.98,19.95 v29.97,19.94 | U2.19 29.57,27.56 29.57,25.21 v29.56,25.2 | v35.15,18.15 35.18,18.12 R4.1
  Bottom 0.25: v29.97,19.94 30.84,19.94 | 30.84,19.94 33.36,19.94 v35.15,18.15 | v29.56,25.2 30.22,25.2 30.89,24.53 30.89,19.99 30.84,19.94
VBAT1
  Top 0.5: C5.1 18.5,19.98 18.8,19.68 18.8,17.27 U1.1 19.73,15.69 C6.1 17.4,14.22
  pour Top (no thermals): 26.54,11.68 24.26,11.68 20.57,15.37 20.57,17.27 18.67,17.27 18.67,14.61 18.54,14.48 17.26,14.48 17.26,13.84 20.07,13.84 25.02,8.89 26.54,8.89
VBUS
  Top 0.25: U2.2 33.39,39.2 33.39,38.72 31.63,36.96 29.97,36.96 29.24,37.69 U2.7
  Top 0.4: CN5.1 29.8,42.8 U2.2